# EAGLE design ManitoBoardL2 (EAGLE 7.2.0)
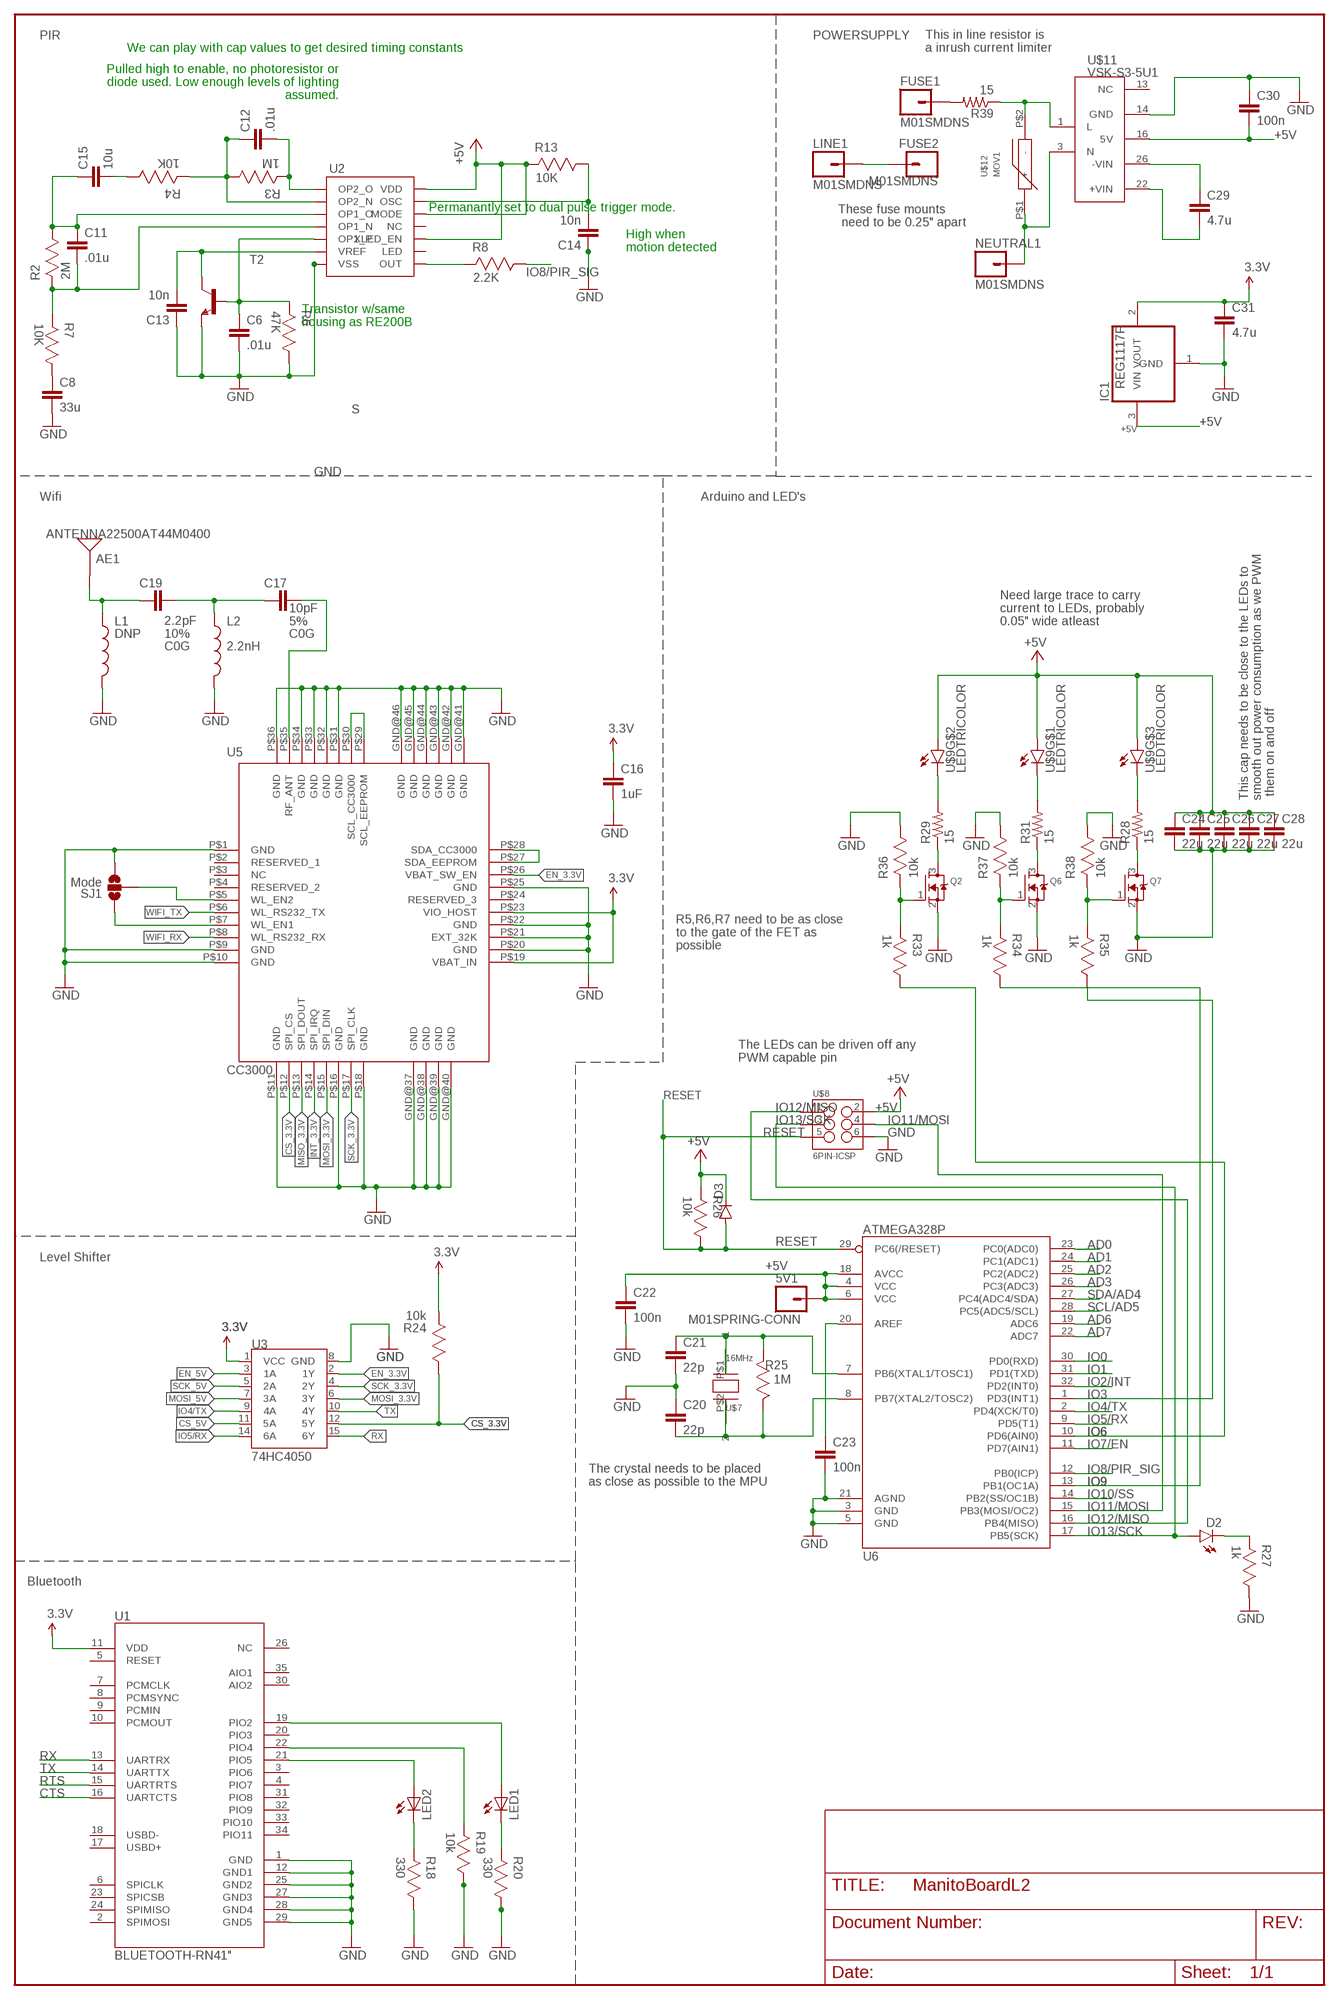
[diagram p0: schematic, sheet 1]

## Parts
5V1  M01SPRING-CONN  [SPRING-CONNECTOR]
AE1  ANTENNA22500AT44M0400  [ANTENNA-CHIP_2500AT44M0400]
C6  .01u  CAP0805  [0805]
C8  33u  CAP0805  [0805]
C11  .01u  CAP0805  [0805]
C12  .01u  CAP0805  [0805]
C13  10n  CAP0805  [0805]
C14  10n  CAP0805  [0805]
C15  10u  CAP0805  [0805]
C16  1uF  CAP0805  [0805]
C17  10pF  CAP0603-CAP  [0603-CAP]
C19  2.2pF  CAP0603-CAP  [0603-CAP]
C20  22p  CAP0603-CAP  [0603-CAP]
C21  22p  CAP0603-CAP  [0603-CAP]
C22  100n  CAP0603-CAP  [0603-CAP]
C23  100n  CAP0603-CAP  [0603-CAP]
C24  22u  CAP0603-CAP  [0603-CAP]
C25  22u  CAP0603-CAP  [0603-CAP]
C26  22u  CAP0603-CAP  [0603-CAP]
C27  22u  CAP0603-CAP  [0603-CAP]
C28  22u  CAP0603-CAP  [0603-CAP]
C29  4.7u  CAP_  [AXIAL-5MM]
C30  100n  CAP0603-CAP  [0603-CAP]
C31  4.7u  CAP0603-CAP  [0603-CAP]
D2  LED-YELLOW0603  [LED-0603]
D3  DIODESOD123  [SOD-123]
FUSE1  M01SMDNS  [1X01NS]
FUSE2  M01SMDNS  [1X01NS]
IC1  REG1117F  [DD-3]
L1  DNP  INDUCTOR0603  [0603]
L2  2.2nH  INDUCTOR0603  [0603]
LED1  LED_ESML0603  [LED_SML0603]
LED2  LED_ESML0603  [LED_SML0603]
LINE1  M01SMDNS  [1X01NS]
NEUTRAL1  M01SMDNS  [1X01NS]
Q2  MOSFET-NREFLOW  [SOT23]
Q6  MOSFET-NREFLOW  [SOT23]
Q7  MOSFET-NREFLOW  [SOT23]
R2  2M  0603RESISTOR1  [0603RESISTOR]
R3  1M  0603RESISTOR1  [0603RESISTOR]
R4  10K  0603RESISTOR1  [0603RESISTOR]
R6  47K  0603RESISTOR1  [0603RESISTOR]
R7  10K  0603RESISTOR1  [0603RESISTOR]
R8  2.2K  0603RESISTOR1  [0603RESISTOR]
R13  10K  0603RESISTOR1  [0603RESISTOR]
R18  330  0603RESISTOR1  [0603RESISTOR]
R19  10k  0603RESISTOR1  [0603RESISTOR]
R20  330  0603RESISTOR1  [0603RESISTOR]
R24  10k  0603RESISTOR1  [0603RESISTOR]
R25  1M  0603RESISTOR1  [0603RESISTOR]
R26  10k  0603RESISTOR1  [0603RESISTOR]
R27  1k  0603RESISTOR1  [0603RESISTOR]
R28  15  RESISTORPTH-1W  [AXIAL-0.6]
R29  15  RESISTORPTH-1W  [AXIAL-0.6]
R31  15  RESISTORPTH-1W  [AXIAL-0.6]
R33  1k  0603RESISTOR1  [0603RESISTOR]
R34  1k  0603RESISTOR1  [0603RESISTOR]
R35  1k  0603RESISTOR1  [0603RESISTOR]
R36  10k  0603RESISTOR1  [0603RESISTOR]
R37  10k  0603RESISTOR1  [0603RESISTOR]
R38  10k  0603RESISTOR1  [0603RESISTOR]
R39  15  RESISTORPTH-1W  [AXIAL-0.6]
SJ1  Mode  SOLDERJUMPER_2WAYPASTE1&2  [SJ_3_PASTE1&2]
T2  -NPN-TO5  [TO5]
U1  BLUETOOTH-RN41"  [RN41]
U2  NCS36000  [SO14]
U3  74HC4050  HEX_CONVERTER  [SO016]
U5  CC3000  [QFN-46_CC3000]
U6  ATMEGA328P  ATMEGA328_SMT  [TQFP32-08]
U$7  16MHz  SMDCRYSTAL  [SMDCRYSTAL]
U$8  6PIN-ICSP  [2X3-ICSP]
U$9  LEDTRICOLOR  [TRICOLORLED]
U$11  VSK-S3-5U1  [VSK-S3-DCAC]
U$12  MOV1  [MOV]

## Nets
3.3V: C16.1 C31.1 IC1.2(VOUT) R24.2 U1.11(VDD) U3.1(VCC) U5.P$19(VBAT_IN) U5.P$23(VIO_HOST)
+5V [usbvcc]: 5V1.P$2 C22.1 C24.1 C25.1 C26.1 C27.1 C28.1 C30.2 D3.C IC1.3(VIN) R13.2 R26.2 U2.10(XLED_EN) U2.12(MODE) U2.14(VDD) U6.4(VCC) U6.6(VCC) U6.18(AVCC) U$8.2(+5V) U$9.A1(A) U$9.A2(A) U$9.A3(A) U$11.16(5V)
AD0: U6.23(PC0(ADC0))
AD1: U6.24(PC1(ADC1))
AD2: U6.25(PC2(ADC2))
AD3: U6.26(PC3(ADC3))
AD6: U6.19(ADC6)
AD7: U6.22(ADC7)
CS_3.3V: R24.1 U3.12(5Y) U5.P$12(SPI_CS)
CS_5V: U3.11(5A)
CTS: U1.16(UARTCTS)
EN_3.3V: U3.2(1Y) U5.P$26(VBAT_SW_EN)
EN_5V: U3.3(1A)
GND: C6.2 C8.2 C13.1 C14.1 C16.2 C20.1 C21.2 C22.2 C23.2 C24.2 C25.2 C26.2 C27.2 C28.2 C30.1 C31.2 IC1.1(GND) L1.2 L2.2 Q2.2(S) Q6.2(S) Q7.2(S) R6.1 R18.1 R19.1 R20.1 R27.1 R36.1 R37.1 R38.1 SJ1.3 T2.1(E) U1.1(GND) U1.12(GND1) U1.25(GND2) U1.27(GND3) U1.28(GND4) U1.29(GND5) U2.7(VSS) U3.8(GND) U5.GND@37(GND) U5.GND@38(GND) U5.GND@39(GND) U5.GND@40(GND) U5.GND@41(GND) U5.GND@42(GND) U5.GND@43(GND) U5.GND@44(GND) U5.GND@45(GND) U5.GND@46(GND) U5.P$1(GND) U5.P$9(GND) U5.P$10(GND) U5.P$11(GND) U5.P$16(GND) U5.P$18(GND) U5.P$20(GND) U5.P$21(EXT_32K) U5.P$22(GND) U5.P$25(GND) U5.P$31(GND) U5.P$32(GND) U5.P$33(GND) U5.P$34(GND) U5.P$36(GND) U6.3(GND) U6.5(GND) U6.21(AGND) U$8.6(GND) U$11.14(GND)
INT_3.3V: U5.P$14(SPI_IRQ)
IO0: U6.30(PD0(RXD))
IO1: U6.31(PD1(TXD))
IO2/INT: U6.32(PD2(INT0))
IO3: R35.1 U6.1(PD3(INT1))
IO4/TX: U3.9(4A) U6.2(PD4(XCK/T0))
IO5/RX: U3.14(6A) U6.9(PD5(T1))
IO6: R33.1 U6.10(PD6(AIN0))
IO7/EN: U6.11(PD7(AIN1))
IO8/PIR_SIG: R8.1 U6.12(PB0(ICP))
IO9: R34.1 U6.13(PB1(OC1A))
IO10/SS: U6.14(PB2(SS/OC1B))
IO11/MOSI: U6.15(PB3(MOSI/OC2)) U$8.4(MOSI)
IO12/MISO: U6.16(PB4(MISO)) U$8.1(MISO)
IO13/SCK: D2.A U6.17(PB5(SCK)) U$8.3(SCK)
MISO_3.3V: U5.P$13(SPI_DOUT)
MOSI_3.3V: U3.6(3Y) U5.P$15(SPI_DIN)
MOSI_5V: U3.7(3A)
N$3: LED2.C R18.2
N$4: C13.2 T2.3(C) U2.6(VREF)
N$6: C11.1 C15.1 R2.1 U2.3(OP1_O)
N$7: C11.2 R2.2 R7.2 U2.4(OP1_N)
N$16: C12.1 R3.1 R4.2 U2.2(OP2_N)
N$20: LED1.C R20.2
N$26: C12.2 R3.2 U2.1(OP2_O)
N$27: C8.1 R7.1
N$32: LED2.A U1.21(PIO5)
N$33: R19.2 U1.22(PIO4)
N$34: LED1.A U1.19(PIO2)
N$36: C15.2 R4.1
N$39: C14.2 R13.1 U2.13(OSC)
N$41: R8.2 U2.8(OUT)
N$43: SJ1.2 U5.P$5(WL_EN2)
N$44: SJ1.1 U5.P$7(WL_EN1)
N$45: U5.P$27(SDA_EEPROM) U5.P$28(SDA_CC3000)
N$46: U5.P$29(SCL_EEPROM) U5.P$30(SCL_CC3000)
N$47: C17.1 C19.2 L2.1
N$48: AE1.FEED(SIGNAL) C19.1 L1.1
N$50: C17.2 U5.P$35(RF_ANT)
N$53: C20.2 R25.1 U6.8(PB7(XTAL2/TOSC2)) U$7.P$2
N$54: C21.1 R25.2 U6.7(PB6(XTAL1/TOSC1)) U$7.P$1
N$55: C23.1 U6.20(AREF)
N$56: D2.C R27.2
N$57: R29.P$2 U$9.C2(C)
N$58: R31.P$2 U$9.C1(C)
N$59: R28.P$2 U$9.C3(C)
N$60: Q7.3(D) R28.P$1
N$61: Q6.3(D) R31.P$1
N$62: Q2.3(D) R29.P$1
N$63: Q2.1(G) R33.2 R36.2
N$64: Q7.1(G) R35.2 R38.2
N$65: Q6.1(G) R34.2 R37.2
N$68: C29.P$1 U$11.26(-VIN)
N$69: C29.P$2 U$11.22(+VIN)
N$70: R39.P$1 U$11.1(L) U$12.P$2(-)
N$71: NEUTRAL1.1 U$11.3(N) U$12.P$1(+)
N$72: FUSE2.1 LINE1.1
N$73: FUSE1.1 R39.P$2
RESET: D3.A R26.1 U6.29(PC6(/RESET)) U$8.5(RESET)
RTS: U1.15(UARTRTS)
RX: U1.13(UARTRX) U3.15(6Y)
S: C6.1 R6.2 T2.2(B) U2.5(OP1_P)
SCK_3.3V: U3.4(2Y) U5.P$17(SPI_CLK)
SCK_5V: U3.5(2A)
SCL/AD5: U6.28(PC5(ADC5/SCL))
SDA/AD4: U6.27(PC4(ADC4/SDA))
TX: U1.14(UARTTX) U3.10(4Y)
WIFI_RX: U5.P$8(WL_RS232_RX)
WIFI_TX: U5.P$6(WL_RS232_TX)
Unconnected: U1.2(SPIMOSI) U1.3(PIO6) U1.4(PIO7) U1.5(RESET) U1.6(SPICLK) U1.7(PCMCLK) U1.8(PCMSYNC) U1.9(PCMIN) U1.10(PCMOUT) U1.17(USBD+) U1.18(USBD-) U1.20(PIO3) U1.23(SPICSB) U1.24(SPIMISO) U1.26(NC) U1.30(AIO2) U1.31(PIO8) U1.32(PIO9) U1.33(PIO10) U1.34(PIO11) U1.35(AIO1) U2.9(LED) U2.11(NC) U5.P$2(RESERVED_1) U5.P$3(NC) U5.P$4(RESERVED_2) U5.P$24(RESERVED_3) U$11.13(NC)

## Notes on the sheet
- PIR
- We can play with cap values to get desired timing constants
- This in line resistor is 
  a inrush current limiter
- Pulled high to enable, no photoresistor or
   diode used. Low enough levels of lighting
   assumed.
- Permanantly set to dual pulse trigger mode.
- These fuse mounts
   need to be 0.25" apart
- High when 
  motion detected
- Transistor w/same 
  housing as RE200B
- Wifi | Arduino and LED's
- Need large trace to carry
  current to LEDs, probably
  0.05" wide atleast
- This cap needs to be close to the LEDs to 
  smooth out power consumption as we PWM
   them on and off
- R5,R6,R7 need to be as close
  to the gate of the FET as
  possible
- The LEDs can be driven off any
  PWM capable pin
- Level Shifter
- The crystal needs to be placed
  as close as possible to the MPU
- Bluetooth

## Library data of the parts
5V1 FUSE1 FUSE2 LINE1 NEUTRAL1 = CharlieCreations:M01: Header 1 Standard 1-pin 0.1" header. Use with straight break away headers (SKU : PRT-00116), right angle break away headers (PRT-00553), swiss pins (PRT-00743), machine pins (PRT-00117), and female headers (PRT-00115).
AE1 = SparkFun-RF:ANTENNA2: Chip antenna Single endded antenna. Common with smaller chip antennas. CHIP4 package is the GPS Chip Antenna SKU: GPS-08418. CHIP5 package is 2.4GHz chip antenna SKU: WRL-00144.
C6 C8 C11-C15 C20-C31 = CharlieCreations:CAP: Capacitor Standard 0603 ceramic capacitor, and 0.1" leaded capacitor.
C16 = SparkFun-Capacitors:CAP: Capacitor Standard 0603 ceramic capacitor, and 0.1" leaded capacitor.
C17 = SparkFun-Capacitors:CAP: Capacitor Standard 0603 ceramic capacitor, and 0.1" leaded capacitor.; COEFF: C0G; TOL: 5%
C19 = SparkFun-Capacitors:CAP: Capacitor Standard 0603 ceramic capacitor, and 0.1" leaded capacitor.; COEFF: C0G; TOL: 10%
D2 = CharlieCreations:LED-YELLOW: Yellow SMD LEDs LilyPad 1206- DIO-09909 0603- DIO-09003; PROD_ID: DIO-09003
D3 = CharlieCreations:DIODE: Diode These are standard reverse protection diodes and small signal diodes. SMA package can handle up to about 1A. SOD-323 can handle about 200mA. What the SOD-323 package when ordering, there are some mfgs out there that are 5-pin packages.
IC1 = burr-brown:REG1117: 800mA and 1A Low Dropout (LDO) Positive Regulator 1.8V, 2.5V, 2.85V, 3.3V, 5V, and Adj; MF: TEXAS INSTRUMENTS; MPN: REG1117FAKTTT; OC_FARNELL: 1296120; OC_NEWARK: 87H2562
L1 L2 = SparkFun-Passives:INDUCTOR: Inductors Basic Inductor/Choke - 0603 and 1206. Footprints are not proven and vary greatly between part numbers. SRN6045- 33uH, 20% 1.4A
LED1 LED2 = eagle-ltspice:LED_E: LED Source: http://www.osram.convergy.de Source: www.luxeon.com Source: www.kingbright.com; SPICEMODEL: NONE; SPICEPREFIX: D; SPICETYPE: diode
Q2 Q6 Q7 = CharlieCreations:MOSFET-N: N-Channel Mosfet 2N7002E - 60V 260mA SOT23 [Digikey: 2N7002ET1GOSTR-ND] - REEL BSH103 - 30V 850mA SOT23 [Digikey: 568-5013-1-ND]
R2-R4 R6-R8 R13 R18-R20 R24-R27 R33-R38 = CharlieCreations:0603RESISTOR: RESISTOR, 0603; MPN: CRCW06031K21FKEA; OC_FARNELL: 1652852; OC_NEWARK: 52K8027; SUPPLIER: Vishay; TOLERANCE: ± 1.0 %; VALUE: 0; WATTAGE: 0.1W
R28 R29 R31 R39 = SparkFun-Passives:RESISTOR: Resistor Basic schematic elements and footprints for 0603, 1206, and PTH resistors.
SJ1 = SparkFun-Passives:SOLDERJUMPER_2WAY: Solder Jumper 2 way solder jumper
T2 = transistor:*-NPN-: NPN Transistror BF959 corrected 2008.03.06
U1 = SparkFun:BLUETOOTH-RN41
U2 = ChrisLib:NCS36000
U3 = SparkFun-DigitalIC:HEX_CONVERTER: Just what it says.
U5 = SparkFun-RF:CC3000: TI CC3000 WiFi Module
U6 = CharlieCreations:ATMEGA328_SMT: 32-Pin Atmega328 part Commonly used on Arduino compatible boards Available in QFP and QFN packages TQFP is IC-09069 QFN is non-stock; PROD_ID: IC-09069
U$7 = CharlieCreations:SMDCRYSTAL
U$8 = CharlieCreations:6PIN-ICSP
U$9 = CharlieCreations:LEDTRICOLOR
U$11 = CharlieCreations:VSK-S3-5U: Universal AC to DC adapter, 5V Output, Manufacturer: CUI Inc
U$12 = CharlieCreations:MOV

## Net classes
2 gnd: width 0.305 mm, drill 0.559 mm, clearance 0.254 mm
3 usbvcc: width 0.508 mm, drill 0.61 mm, clearance 0.254 mm

## Board
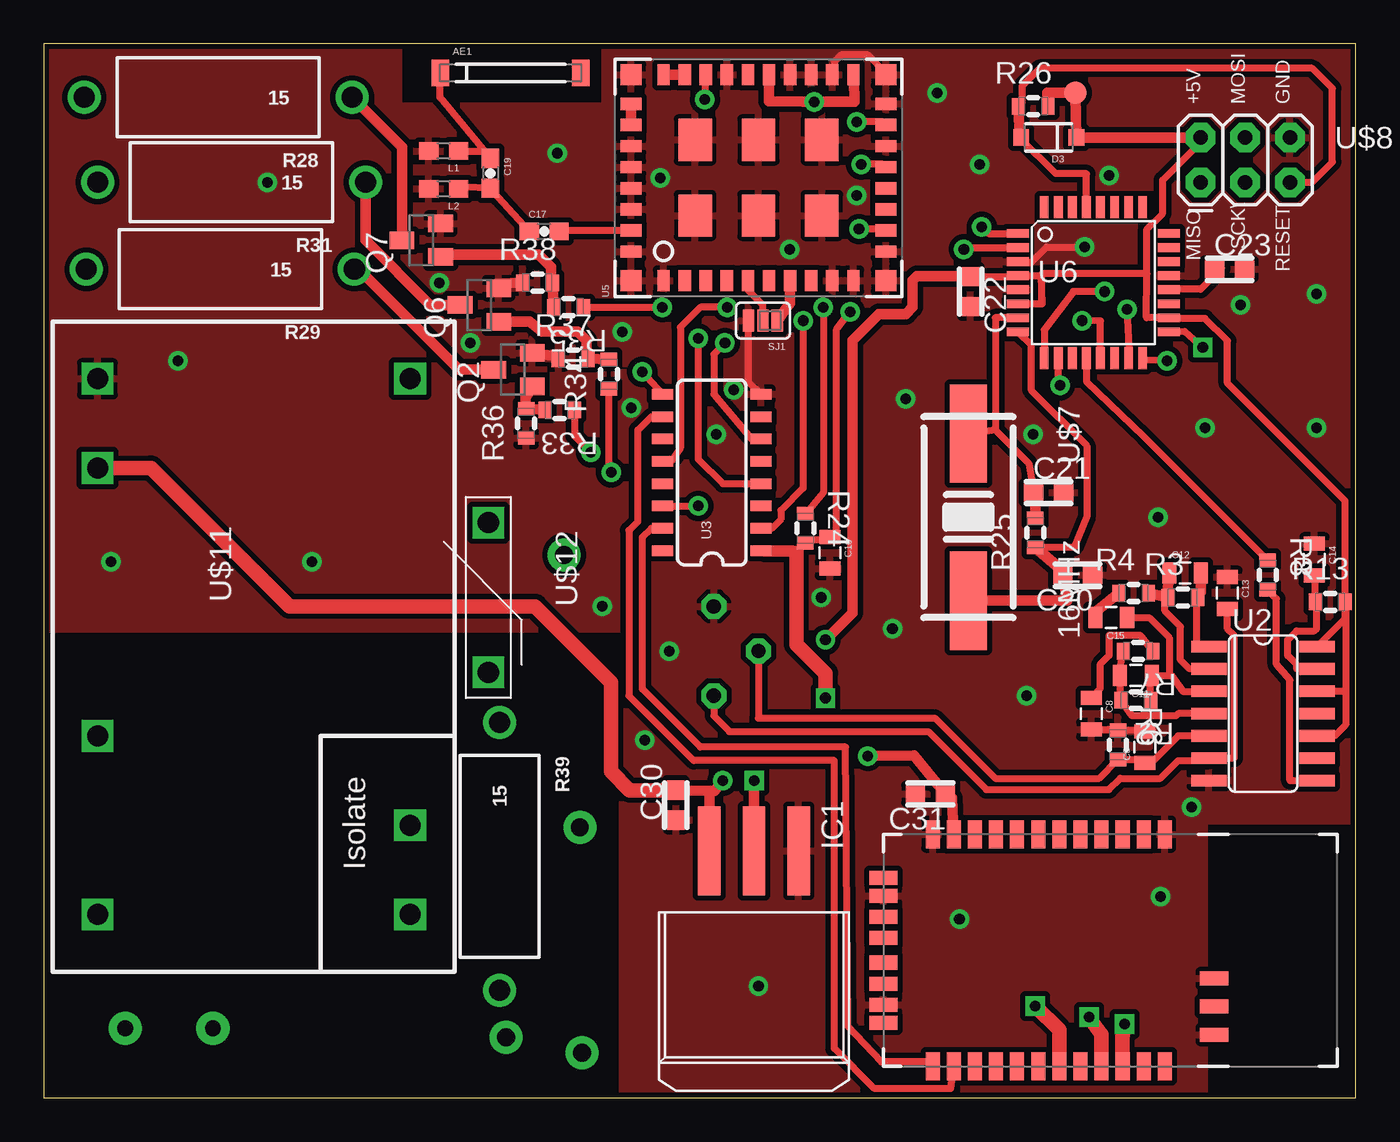
[diagram p1: board, top side]
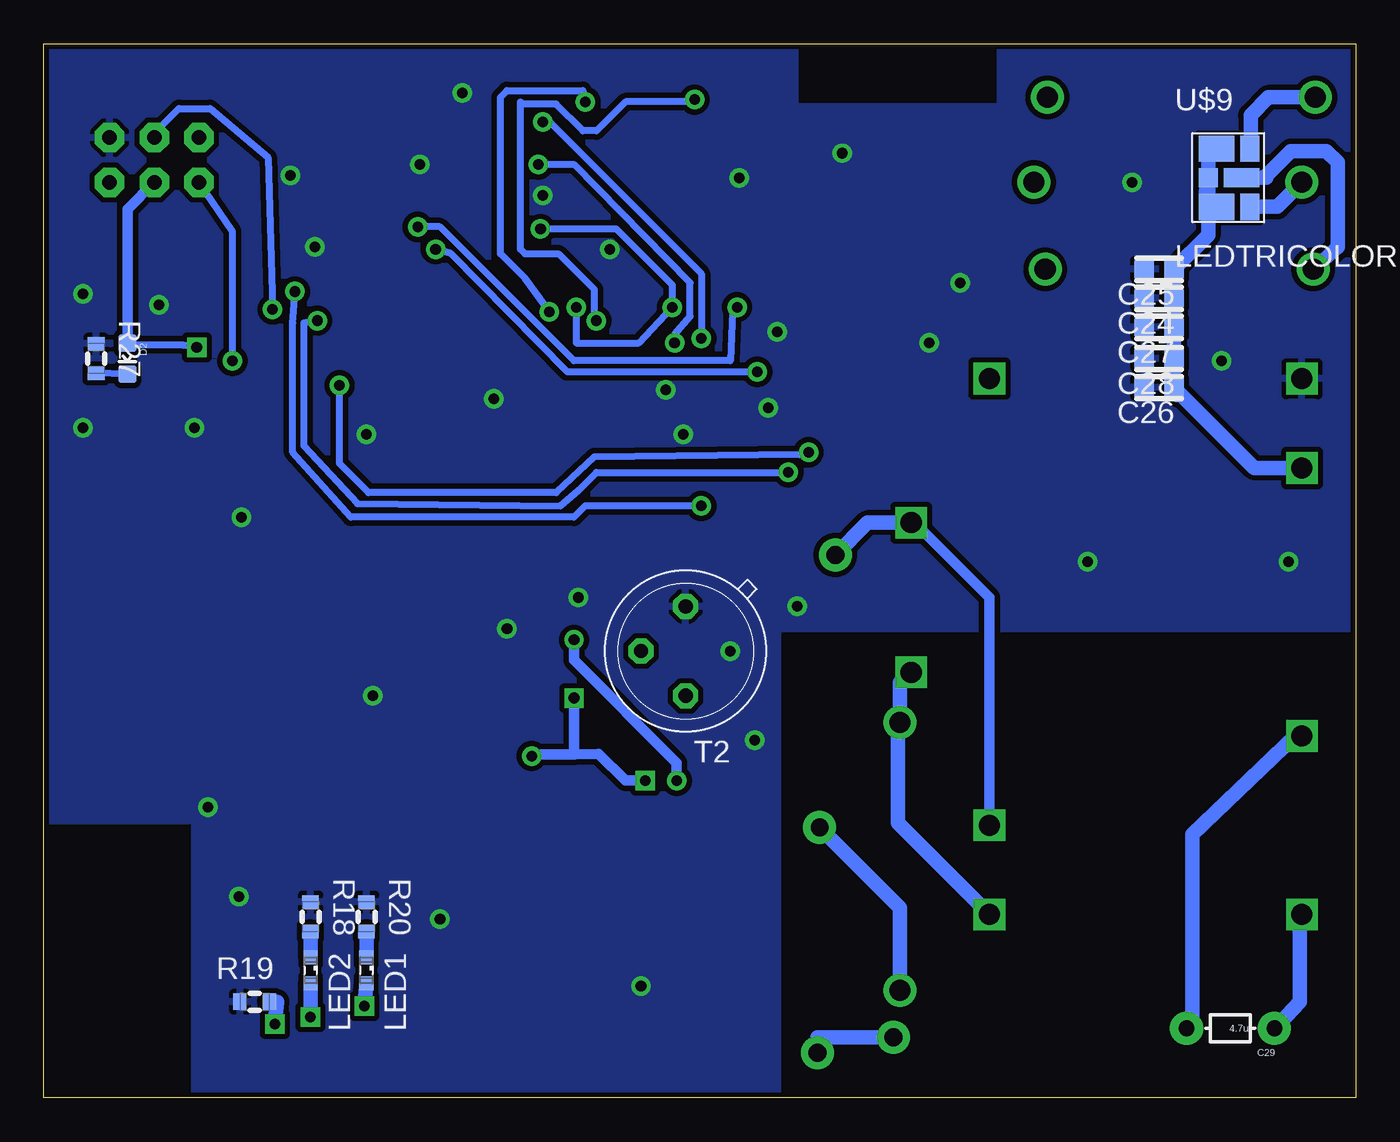
[diagram p2: board, bottom side, seen from below]

Size 74.6 x 59.93 mm. Coordinates in mm from the lower left corner, seen from the top.
Outline: 0,0 74.6,0 74.6,59.93 0,59.93 0,0
Copper layers (1*16): Top 0.035mm / dielectric 1.5mm / Bottom 0.035mm
Design rules "SparkFun": minimum track width 8mil, minimum drill 20mil, track to track 8mil, track to pad 8mil, pad to pad 8mil, via to via 8mil, smd to smd 8mil, copper to edge 8mil, drill to drill 8mil, minimum pad ring 12mil, minimum via ring 10mil, stop-mask expansion 4mil, vias tented up to drill 20mil, thermal gap 10mil

### Footprints (pad centres in the part's own frame; a part is rotated, then mirrored left to right if it is on the bottom)
SPRING-CONNECTOR = smd 1.27 x 1.27: P$2 0,0
ANTENNA-CHIP_2500AT44M0400 = smd 1 x 1.5: FEED -4,0; NC 4,0
0805 = smd 0.8 x 1.2: 1 -0.9,0; 2 0.9,0
0603-CAP = smd 1.1 x 1: 1 -0.85,0; 2 0.85,0
AXIAL-5MM = drill 0.9 pad 1.88: P$1 -2.5,0; P$2 2.5,0
LED-0603 = smd 1 x 1: A 0,-0.877; C 0,0.877
SOD-123 = smd 0.9 x 0.95: A 1.575,0; C -1.575,0
1X01NS = drill 1.016 pad 1.88: 1 0,0
DD-3 = smd 1.27 x 5.08: 1 -2.54,-7.938; 2 0,-7.938; 3 2.54,-7.938
0603 = smd 1.1 x 1: 1 -0.85,0; 2 0.85,0
LED_SML0603 = smd 0.8 x 0.8: A 0.75,0; C -0.75,0
SOT23 = smd 1 x 1.4: 1 -0.95,-1.1; 2 0.95,-1.1; 3 0,1.1
0603RESISTOR = smd 0.762 x 0.94: 1 -0.838,0; 2 0.838,0
AXIAL-0.6 = drill 1.2 pad 1.88: P$1 -7.62,0; P$2 7.62,0
SJ_3_PASTE1&2 = smd 0.635 x 1.27: 1 -0.813,0; 2 0,0; 3 0.813,0
TO5 = drill 0.813 octagon: 1 0,-2.54; 2 2.54,0; 3 0,2.54
RN41 = smd 0.8 x 1.6: 1 -6.6,-6.6; 2 -5.4,-6.6; 3 -4.2,-6.6; 4 -3,-6.6; 5 -1.8,-6.6; 6 -0.6,-6.6; 7 0.6,-6.6; 8 1.8,-6.6; 9 3,-6.6; 10 4.2,-6.6; 11 5.4,-6.6; 12 6.6,-6.6; 13 6.6,6.6; 14 5.4,6.6; 15 4.2,6.6; 16 3,6.6; 17 1.8,6.6; 18 0.6,6.6; 19 -0.6,6.6; 20 -1.8,6.6; 21 -3,6.6; 22 -4.2,6.6; 23 -5.4,6.6; 24 -6.6,6.6 | smd 1.6 x 0.8: 25 -9.4,4.8; 26 -9.4,3.2; 27 -9.4,1.6; 28 9.4,3.1; 29 9.4,-3.1; 30 9.4,-4.122; 31 9.4,-1.9; 32 9.4,-0.7; 33 9.4,0.7; 34 9.4,1.9; 35 9.4,4.122
SO14 = smd 0.66 x 2.032: 1 -3.81,-3.073; 2 -2.54,-3.073; 3 -1.27,-3.073; 4 0,-3.073; 5 1.27,-3.073; 6 2.54,-3.073; 7 3.81,-3.073; 8 3.81,3.073; 9 2.54,3.073; 10 1.27,3.073; 11 0,3.073; 12 -1.27,3.073; 13 -2.54,3.073; 14 -3.81,3.073
SO016 = smd 0.6 x 1.2: 1 -4.445,-2.8; 2 -3.175,-2.8; 3 -1.905,-2.8; 4 -0.635,-2.8; 5 0.635,-2.8; 6 1.905,-2.8; 7 3.175,-2.8; 8 4.445,-2.8; 9 4.445,2.8; 10 3.175,2.8; 11 1.905,2.8; 12 0.635,2.8; 13 -0.635,2.8; 14 -1.905,2.8; 15 -3.175,2.8; 16 -4.445,2.8
QFN-46_CC3000 = smd 2.4 x 1.9: GND@37 -2.15,3.6; GND@38 -2.15,0; GND@39 -2.15,-3.6; GND@40 2.15,3.6; GND@41 2.15,0; GND@42 2.15,-3.6 | smd 1.2 x 1.2: GND@43 -5.85,7.25; GND@44 -5.85,-7.25; GND@45 5.85,-7.25; GND@46 5.85,7.25 | smd 1.2 x 0.7: P$1 -5.85,5.4; P$2 -5.85,4.2; P$3 -5.85,3; P$4 -5.85,1.8; P$5 -5.85,0.6; P$6 -5.85,-0.6; P$7 -5.85,-1.8; P$8 -5.85,-3; P$9 -5.85,-4.2; P$10 -5.85,-5.4; P$19 5.85,-5.4; P$20 5.85,-4.2; P$21 5.85,-3; P$22 5.85,-1.8; P$23 5.85,-0.6; P$24 5.85,0.6; P$25 5.85,1.8; P$26 5.85,3; P$27 5.85,4.2; P$28 5.85,5.4 | smd 0.7 x 1.2: P$11 -4.2,-7.25; P$12 -3,-7.25; P$13 -1.8,-7.25; P$14 -0.6,-7.25; P$15 0.6,-7.25; P$16 1.8,-7.25; P$17 3,-7.25; P$18 4.2,-7.25; P$29 4.2,7.25; P$30 3,7.25; P$31 1.8,7.25; P$32 0.6,7.25; P$33 -0.6,7.25; P$34 -1.8,7.25; P$35 -3,7.25; P$36 -4.2,7.25
TQFP32-08 = smd 1.25 x 0.5: 1 -4.293,2.8; 2 -4.293,2; 3 -4.293,1.2; 4 -4.293,0.4; 5 -4.293,-0.4; 6 -4.293,-1.2; 7 -4.293,-2; 8 -4.293,-2.8; 17 4.293,-2.8; 18 4.293,-2; 19 4.293,-1.2; 20 4.293,-0.4; 21 4.293,0.4; 22 4.293,1.2; 23 4.293,2; 24 4.293,2.8 | smd 0.5 x 1.25: 9 -2.8,-4.293; 10 -2,-4.293; 11 -1.2,-4.293; 12 -0.4,-4.293; 13 0.4,-4.293; 14 1.2,-4.293; 15 2,-4.293; 16 2.8,-4.293; 25 2.8,4.293; 26 2,4.293; 27 1.2,4.293; 28 0.4,4.293; 29 -0.4,4.293; 30 -1.2,4.293; 31 -2,4.293; 32 -2.8,4.293
SMDCRYSTAL = smd 5.588 x 2.108: P$1 -4.75,0; P$2 4.75,0
2X3-ICSP = drill 0.826 pad 1.676 octagon: 1 -2.54,-1.27; 2 -2.54,1.27; 3 0,-1.27; 4 0,1.27; 5 2.54,-1.27; 6 2.54,1.27
TRICOLORLED = smd 2.007 x 1.499: A1 -0.152,-1.651; A3 -0.152,1.651 | smd 1.092 x 1.092: A2 -0.635,0 | smd 1.092 x 1.499: C1 1.727,-1.651; C3 1.727,1.651 | smd 2.007 x 1.092: C2 1.27,0
VSK-S3-DCAC = drill 1.2 square: 1 -15.24,-7.62; 3 -10.16,-7.62; 13 15.24,-7.62; 14 15.24,10.16; 16 10.16,10.16; 22 -5.08,10.16; 26 -15.24,10.16
MOV = drill 1.2 square: P$1 -4.255,0; P$2 4.255,0

### Placement (x,y rotation side)
5V1  58.67,57.15 0 top
AE1  26.54,58.29 0 top
C6  62.61,19.94 90 top
C8  59.56,21.84 270 top
C11  62.1,24 180 top
C12  64.9,29.84 0 top
C13  67.31,28.7 270 top
C14  72.26,30.61 270 top
C15  60.71,27.3 180 top
C16  44.7,30.99 270 top
C17  28.45,49.28 0 top
C19  25.4,52.58 270 top
C20  58.8,29.72 180 top
C21  57.15,34.42 0 top
C22  52.7,45.85 270 top
C23  67.44,47.12 0 top
C24  11.18,45.47 180 bottom
C25  11.18,47.12 180 bottom
C26  11.18,40.39 180 bottom
C27  11.18,43.81 180 bottom
C28  11.18,42.04 180 bottom
C29  7.11,3.94 180 bottom
C30  35.94,16.64 90 top
C31  50.42,17.27 180 top
D2  69.85,42.04 180 bottom
D3  57.15,54.61 180 top
FUSE1  30.48,15.37 0 top
FUSE2  30.61,2.54 90 top
IC1  40.39,6.1 180 top
L1  22.73,53.85 180 top
L2  22.73,51.69 180 top
LED1  56.26,7.24 270 bottom
LED2  59.44,7.24 270 bottom
LINE1  26.29,3.43 0 top
NEUTRAL1  29.59,30.86 0 top
Q2  26.67,41.4 90 top
Q6  24.77,45.09 90 top
Q7  21.46,48.77 90 top
R2  62.1,22.61 180 top
R3  64.77,28.45 0 top
R4  61.98,28.7 0 top
R6  61.09,20.07 270 top
R7  62.23,25.4 180 top
R8  69.6,29.72 270 top
R13  73.15,28.19 0 top
R18  59.44,10.29 270 bottom
R19  62.61,5.46 0 bottom
R20  56.26,10.29 270 bottom
R24  43.31,32.38 270 top
R25  56.39,32.13 90 top
R26  56.26,56.39 0 top
R27  71.63,42.04 270 bottom
R28  9.91,56.9 180 top
R29  10.03,47.12 180 top
R31  10.67,52.07 180 top
R33  29.34,39.12 180 top
R34  32.13,41.15 90 top
R35  29.84,44.96 180 top
R36  27.43,38.35 90 top
R37  30.1,42.04 0 top
R38  28.07,46.35 0 top
R39  25.91,13.72 270 top
SJ1  40.89,44.2 180 top
T2  38.1,25.4 180 bottom
U1  57.15,8.38 180 top
U2  69.34,21.84 270 top
U3  37.97,35.56 90 top
U5  40.64,52.32 90 top
U6  59.69,46.35 0 top
U$7  52.58,33.02 270 top
U$8  68.33,53.34 0 top
U$9  7.75,52.32 0 bottom
U$11  13.21,25.65 90 top
U$12  25.27,28.45 270 top

### Tracks (layer width: path | path; a pad name or v marks a point on that pad's centre or on a via)
3.3V  (via drill 0.6)
  Top 0.406: U3.1 40.9,30.99 42.8,30.99 43.31,31.5 R24.2 43.51,31.75 45.09,31.75 | 45.09,31.75 C16.1 | 45.09,31.75 45.09,43.69 v45.85,44.7 | v43.81,56.64 43.19,56.64 | U1.11 51.69,15.04 51.69,15.24
  Top 0.61: U5.P$23 41.24,56.68 43.19,56.64 43.31,56.64 v43.81,56.64 46.1,56.64 46.1,56.97 U5.P$19 | 51.69,15.17 51.69,15.24 51.69,15.75 51.65,17.06 C31.1 49.49,19.47 v46.86,19.43 | IC1.2 v40.39,18.03 | 42.55,31.11 U3.1
  Top 0.813: v44.45,22.73 44.45,24.13 42.8,25.78 42.8,30.99
  Bottom 0.406: v45.85,44.7 47.24,46.61 48.64,48.01 48.64,56.9 48.26,57.28 43.94,57.28 43.94,56.77 v43.81,56.64
  Bottom 0.61: 44.42,19.51 43.05,19.56 41.53,18.03 v40.39,18.03 | v44.45,22.73 44.45,19.54 44.42,19.51 | 44.42,19.51 46.78,19.51 v46.86,19.43
+5V  (via drill 0.6)
  Top 0.406: C22.1 55.4,46.7 U6.4 55.4,46.74 56.71,46.74 | U6.6 56.77,45.16 | 56.77,45.16 56.77,46.86 | 56.77,46.86 56.71,46.74 | R13.2 73.99,27.23 U2.14 | 74.04,23.11 U2.12 | U2.10 73.41,20.57 74.04,21.21 74.04,23.11 | 62.74,46.86 62.71,44.35 U6.18 64.02,44.32 66.04,44.32 67.31,43.05 67.31,40.64 73.99,33.96 R13.2 | 62.74,46.86 56.77,46.86 | 56.71,46.74 56.77,45.16 | 62.74,46.86 62.74,49.4 63.63,50.29 63.63,52.2 65.79,54.36 U$8.2 | R13.2 74.04,28.14 74.04,23.11
  Top 0.61: U$8.2 D3.C 58.67,57.02 5V1.P$2 57.07,57.15 R26.2 | IC1.3 37.85,17.44 C30.2 38.14,17.44 v38.61,18.03 | C22.1 52.67,46.74 49.66,46.74 49.4,46.48 49.4,44.96 49.02,44.58 47.5,44.58 45.97,43.05 45.97,27.56 v44.45,26.04
  Top 0.813: C30.2 33.31,17.49 32.26,18.54 32.26,23.62 27.94,27.94 13.97,27.94 6.1,35.81 U$11.16
  Bottom 0.61: v44.45,26.04 44.45,24.89 38.61,19.05 v38.61,18.03
  Bottom 0.813: C26.1 C28.1 C27.1 C24.1 C25.1 8.38,49.06 U$9.A2 | U$9.A3 8.38,53.75 U$9.A2 | U$9.A1 8.51,51.54 U$9.A2 | 10.16,39.97 C26.1 | U$11.16 5.75,35.81 C26.1
CS_3.3V  (via drill 0.6)
  Top 0.406: U5.P$12 47.81,49.4 v46.35,49.4 | U3.12 35.69,36.2 36.2,36.96 36.2,43.81 37.34,44.96 v38.86,44.96 | 43.18,33.22 R24.1 43.26,33.1 44.32,34.42 v44.32,44.96
  Bottom 0.406: v44.32,44.96 44.32,42.93 40.77,42.93 v38.86,44.96 38.86,46.23 42.04,49.4 v46.35,49.4
EN_3.3V  (via drill 0.6)
  Top 0.406: v37.59,56.77 37.64,56.77 U5.P$26 | v43.18,44.2 43.18,34.67 41.91,33.4 41.91,32.89 41.4,32.38 U3.2
  Bottom 0.406: v37.59,56.77 37.59,56.64 41.53,56.64 43.18,54.99 43.94,54.99 45.47,56.52 47.37,56.52 47.5,56.64 47.5,48.26 47.24,48.01 45.34,48.01 43.31,45.97 43.31,44.32 v43.18,44.2
GND  (via drill 0.6)
  Top 0.406: C6.2 62.55,20.9 R6.1 59.6,20.9 C8.2 | U5.GND@45 47.89,58.28 46.86,59.31 45.34,59.31 44.96,58.93 44.96,58.29 U5.P$20 | U3.8 40.08,40.7 SJ1.3 | U6.3 55.45,47.5 56.13,47.5 57.02,48.39 v59.18,48.39
  Top 0.61: R37.1 29.08,42.22 27.81,42.29 27.75,42.35 Q2.2 | R38.1 25.77,46.29 Q6.2
  other vias: 48.26,26.67 52.07,10.16 63.5,11.43 29.21,53.72 49.02,39.75 50.8,57.15 66.04,38.1 63.37,33.02 15.24,30.48 72.39,45.72 68.07,45.09 39.24,40.26 56.26,37.72 32.89,43.56 12.7,52.07 3.81,30.48 7.62,41.91 40.64,6.35 55.88,22.86 72.39,38.1 65.28,16.51 35.56,25.4 31.75,27.94 38.23,37.72 53.21,53.09 34.16,20.32 60.58,52.45 33.4,39.24 35.05,52.32 42.42,48.26 46.23,51.31 44.2,28.45 24.26,42.93 22.48,46.35
  pour Top (isolate 0.305): -0.13,26.67 32.89,26.67 32.89,0 66.04,0 66.04,15.75 74.93,15.75 74.93,60.07 31.88,60.07 31.88,56.39 20.19,56.39 20.19,59.69 0,59.69
  pour Bottom (isolate 0.305): -0.13,26.67 32.89,26.67 32.89,0 66.04,0 66.04,15.75 75.06,15.75 75.06,60.07 31.88,60.07 31.88,56.39 20.19,56.39 20.19,59.69 0,59.69
IO3  (via drill 0.6)
  Top 0.406: R35.1 v35.18,44.96 | v53.34,49.53 53.72,49.16 U6.1
  Bottom 0.406: v35.18,44.96 35.43,44.7 35.56,41.91 44.45,41.91 52.07,49.53 v53.34,49.53
IO4/TX  (via drill 0.6)
  Top 0.406: U3.9 v34.04,41.28 | v52.32,48.26 52.55,48.35 U6.2
  Bottom 0.406: v34.04,41.28 35.3,41.27 44.83,41.27 51.44,48.01 v52.32,48.26
IO5/RX  (via drill 0.6)
  Top 0.406: U3.14 v37.21,33.66 | v60.33,45.85 58.55,45.85 56.89,43.68 U6.9
  Bottom 0.406: v37.21,33.66 43.81,33.66 44.45,33.02 57.15,33.02 60.45,36.7 60.45,44.07 v60.33,45.85
IO6  (via drill 0.6)
  Top 0.406: v57.78,40.51 57.69,40.61 U6.10 | R33.1 30.18,37.64 v31.11,36.7
  Bottom 0.406: v31.11,36.7 31.62,36.58 43.31,36.45 45.47,34.42 56.13,34.42 57.78,36.07 v57.78,40.51
IO8/PIR_SIG
  Top 0.406: U6.12 59.29,40.73 62.59,37.56 R8.1
IO9  (via drill 0.6)
  Top 0.406: U6.13 60.09,44.18 v59.05,44.2 | v32.26,35.56 32.13,35.69 R34.1 32.13,40.51
  Bottom 0.406: v59.05,44.2 59.82,44.07 59.82,37.08 56.77,33.78 45.21,33.66 44.2,34.54 43.18,35.56 v32.26,35.56
IO11/MOSI  (via drill 0.6)
  Top 0.406: v61.59,44.83 61.72,42.09 U6.15
  Bottom 0.406: U$8.4 68.33,54.86 66.93,56.26 65.15,56.26 61.85,53.47 v61.59,44.83
IO12/MISO  (via drill 0.6)
  Top 0.406: v63.88,41.91 62.61,41.94 U6.16
  Bottom 0.406: U$8.1 63.88,49.28 v63.88,41.91
IO13/SCK  (via drill 0.6)
  Top 0.406: U6.17 64.87,43.59 v65.91,42.67
  Bottom 0.406: v65.91,42.67 66.67,42.8 69.84,42.8 D2.A
  Bottom 0.61: U$8.3 69.85,50.53 D2.A
MOSI_3.3V  (via drill 0.6)
  Top 0.406: U5.P$15 47.73,53.09 v46.48,53.09 | v38.73,42.93 38.1,42.29 38.1,40.01 40.26,37.47 U3.6
  Bottom 0.406: v38.73,42.93 38.73,43.43 37.85,44.45 37.85,46.35 44.45,53.09 v46.48,53.09
N$3
  Bottom 0.813: LED2.C R18.2
N$4
  Top 0.406: 67.55,27.7 C13.2 67.31,26.67 67.69,26.29 67.69,19.3 U2.6 66.14,19.18 64.52,19.18 63.5,18.16 61.21,18.16 60.58,17.53 53.59,17.53 50.29,20.83 38.99,20.83 38.1,21.72 T2.3
N$6
  Top 0.406: R2.1 62.94,23.56 C11.1 64.14,24 | 64.14,24 64.77,23.11 U2.3 | C15.1 62.87,27.3 64.01,26.16 64.01,24.13 64.14,24
N$7
  Top 0.406: R7.2 61.27,24.96 C11.2 61.2,23.05 R2.2 61.9,21.72 64.39,21.72 64.52,21.84 U2.4
N$16
  Top 0.406: U2.2 65.15,24.38 64.64,24.89 64.64,26.8 63.75,27.69 63.75,27.99 R3.1
  Top 0.61: C12.1 63.95,29.83 R3.1 R4.2
N$20
  Bottom 0.813: LED1.C R20.2
N$26
  Top 0.406: R3.2 65.53,28.45 65.53,25.53 66.14,25.53 U2.1
  Top 0.61: C12.2 65.8,28.76 R3.2
N$27
  Top 0.406: R7.1 62.43,26.21 62.36,26.29 60.58,26.29 60.58,25.15 60.07,24.64 60.07,23.25 C8.1
N$32  (via drill 0.6)
  Top 0.813: U1.21 60.15,3.6 v59.44,4.57
  Bottom 0.813: v59.44,4.57 LED2.A
N$33  (via drill 0.6)
  Top 0.813: U1.22 61.35,3.43 v61.47,4.19
  Bottom 0.813: v61.47,4.19 61.34,5.46 R19.2
N$34  (via drill 0.6)
  Top 0.813: U1.19 57.75,3.85 v56.39,5.21
  Bottom 0.813: v56.39,5.21 LED1.A
N$36
  Top 0.61: C15.2 59.81,27.62 R4.1
N$39
  Top 0.406: U2.13 71.25,24.38 71.25,24.64 70.74,25.15 70.74,26.04 71.25,26.54 72.26,26.54 72.39,26.67 72.39,27.99 R13.1 72.31,29.68 C14.2
N$41
  Top 0.406: U2.8 70.87,18.03 70.87,23.75 70.1,24.64 70.1,28.37 R8.2
N$43
  Top 0.406: SJ1.2 40.89,45.09 40.04,45.94 U5.P$5
N$44
  Top 0.61: U5.P$7 42.44,45.18 SJ1.1
N$45
  Top 0.61: U5.P$28 U5.P$27
N$46
  Top 0.61: U5.P$29 U5.P$30
N$47
  Top 0.406: C17.1 25.87,51.18 25.53,51.56 C19.2 23.83,51.78 L2.1
N$48
  Top 0.406: AE1.FEED 22.52,56.9 C19.1 24.98,53.85 L1.1
N$50
  Top 0.406: U5.P$35 29.73,49.32 C17.2
N$53
  Top 0.406: U6.8 56.13,42.82 56.13,40.26 59.31,37.08 59.31,33.02 58.6,31.29 R25.1
  Top 0.61: U$7.P$2 58.2,28.27 C20.2 58.22,29.72 R25.1
N$54
  Top 0.406: U6.7 54.1,44.35 54.1,37.97 | 54.1,37.97 52.45,37.72 U$7.P$1 | 54.1,37.97 56.01,36.07 56.3,34.29
  Top 0.61: R25.2 56.39,34.29 56.3,34.29 C21.1
N$55
  Top 0.406: C23.1 66.97,47.16 65.79,45.97 64,45.97 U6.20
N$56
  Bottom 0.406: D2.C 69.94,41.16 R27.2
N$57
  Bottom 0.813: U$9.C2 5.08,52.32 5.08,52.45 3.68,53.85 1.65,53.85 1.02,53.21 1.02,48.39 R29.P$2
N$58
  Bottom 0.813: U$9.C1 4.45,50.67 R31.P$2
N$59
  Bottom 0.813: R28.P$2 4.95,56.9 5.97,55.88 5.97,54.03 U$9.C3
N$60
  Top 0.61: Q7.3 20.36,54.06 R28.P$1
N$61
  Top 0.61: R31.P$1 18.29,48.77 21.97,45.09 Q6.3
N$62
  Top 0.61: R29.P$1 17.91,47.12 23.62,41.4 Q2.3
N$63
  Top 0.61: R33.2 R36.2 27.38,39.83 Q2.1
N$64
  Top 0.61: R35.2 R38.2 28.83,46.43 28.83,47.24 28.13,47.95 22.79,47.95 Q7.1
N$65
  Top 0.61: R34.2 R37.2 30.86,42.11 30.86,43.05 30.35,43.56 28.32,43.56 27.62,44.13 Q6.1
N$68
  Bottom 0.813: C29.P$1 4.7,3.81 3.17,5.46 3.17,10.29 U$11.26
N$69
  Bottom 0.813: U$11.22 3.43,20.57 9.27,14.99 9.27,3.98 C29.P$2
N$70
  Bottom 0.61: U$11.1 21.21,10.41 | 26.04,21.21 R39.P$1
  Bottom 0.813: U$12.P$2 25.91,23.62 R39.P$1 | 26.04,21.21 26.04,15.62 U$11.1
N$71
  Bottom 0.61: U$12.P$1 25.08,32.7 20.83,28.45 U$11.3
  Bottom 0.813: U$12.P$1 27.75,32.7 NEUTRAL1.1
N$72
  Bottom 0.813: FUSE2.1 30.61,3.43 LINE1.1
N$73
  Bottom 0.813: R39.P$2 25.91,10.79 FUSE1.1
RESET
  Top 0.406: U6.29 59.29,52.55 59.26,52.58 57.53,52.58 55.55,54.56 55.5,54.56 | U$8.5 72.14,52.07 73.28,53.21 73.28,57.4 72.14,58.55 56.64,58.55 55.63,57.53 55.63,56.59 R26.1
  Top 0.61: D3.A 55.5,54.56 R26.1
RX
  Top 0.406: U1.13 50.3,2.03 47.62,2.03 45.72,4.06 45.59,19.94 37.34,19.94 34.04,23.24 34.04,31.88 34.54,32.38 U3.15
S
  Top 0.406: U2.5 64.52,20.57 62.98,19.04 C6.1 62.42,19.23 R6.2 60.02,18.16 54.1,18.16 50.67,21.59 40.64,21.59 T2.2
SCK_3.3V  (via drill 0.6)
  Top 0.406: U5.P$17 47.72,55.5 v46.23,55.5 | v37.21,43.18 37.21,36.32 38.61,34.92 U3.4
  Bottom 0.406: v46.23,55.5 45.85,55.5 37.21,46.86 v37.21,43.18
TX
  Top 0.406: U1.14 51.69,1.72 51.56,0.51 47.24,0.51 44.96,2.79 44.96,19.18 36.96,19.18 33.27,22.86 33.27,32.26 33.78,32.77 33.78,37.97 34.54,38.73 U3.10